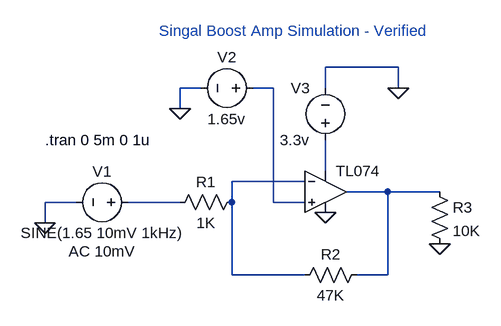
[diagram p0: schematic SDR-SingalBoostAmpSim.asc]
SDR-SingalBoostAmpSim.asc, the LTspice schematic file:
Version 4.1
SHEET 1 880 680
WIRE 240 -32 128 -32
WIRE -64 0 -96 0
WIRE 48 0 16 0
WIRE 128 0 128 -32
WIRE 240 0 240 -32
WIRE -96 32 -96 0
WIRE 128 128 128 80
WIRE 96 144 -16 144
WIRE 224 160 160 160
WIRE 304 160 224 160
WIRE -256 176 -304 176
WIRE -96 176 -176 176
WIRE -16 176 -16 144
WIRE 48 176 48 0
WIRE 96 176 48 176
WIRE -304 208 -304 176
WIRE -16 288 -16 176
WIRE 96 288 -16 288
WIRE 224 288 224 160
WIRE 224 288 176 288
FLAG 128 192 0
FLAG -96 32 0
FLAG -304 208 0
FLAG 304 240 0
FLAG 240 0 0
SYMBOL OpAmps\\UniversalOpAmp2 128 160 R0
SYMATTR InstName TL074
SYMBOL res 0 160 R90
WINDOW 0 0 56 VBottom 2
WINDOW 3 32 56 VTop 2
SYMATTR InstName R1
SYMATTR Value 1K
SYMBOL res 192 272 R90
WINDOW 0 0 56 VBottom 2
WINDOW 3 32 56 VTop 2
SYMATTR InstName R2
SYMATTR Value 47K
SYMBOL voltage -160 176 R90
WINDOW 0 -32 56 VBottom 2
WINDOW 3 32 56 VTop 2
WINDOW 123 60 56 VTop 2
WINDOW 39 0 0 Left 0
SYMATTR InstName V1
SYMATTR Value SINE(1.65 10mV 1kHz)
SYMATTR Value2 AC 10mV
SYMBOL voltage 32 0 R90
WINDOW 0 -32 56 VBottom 2
WINDOW 3 32 56 VTop 2
WINDOW 123 0 0 Left 0
WINDOW 39 0 0 Left 0
SYMATTR InstName V2
SYMATTR Value 1.65v
SYMBOL res 288 144 R0
SYMATTR InstName R3
SYMATTR Value 10K
SYMATTR SpiceLine tol=1 pwr=0.1
SYMBOL voltage 128 96 R180
WINDOW 0 24 96 Left 2
WINDOW 3 24 16 Left 2
WINDOW 123 0 0 Left 0
WINDOW 39 0 0 Left 0
SYMATTR InstName V3
SYMATTR Value 3.3v
TEXT -304 80 Left 2 !.tran 0 5m 0 1u
TEXT -128 -88 Left 2 ;Singal Boost Amp Simulation - Verified

The netlist it stands for:
* SDR-SingalBoostAmpSim.asc
X§TL074 N001 N003 N002 0 N004 level2 Avol=1Meg GBW=10Meg Slew=10Meg Ilimit=25m Rail=0 Vos=0 En=0 Enk=0 In=0 Ink=0 Rin=500Meg  ; pins In+ In- V+ V- OUT
R1 N003 N005 1K
R2 N004 N003 47K
V1 N005 0 SINE(1.65 10mV 1kHz) AC 10mV
V2 N001 0 1.65v
R3 N004 0 10K tol=1 pwr=0.1
V3 N002 0 3.3v
.tran 0 5m 0 1u
* Singal Boost Amp Simulation - Verified
.lib UniversalOpAmp2.lib
.backanno
.end